# EAGLE schematic schematic (EAGLE 8.5.1)
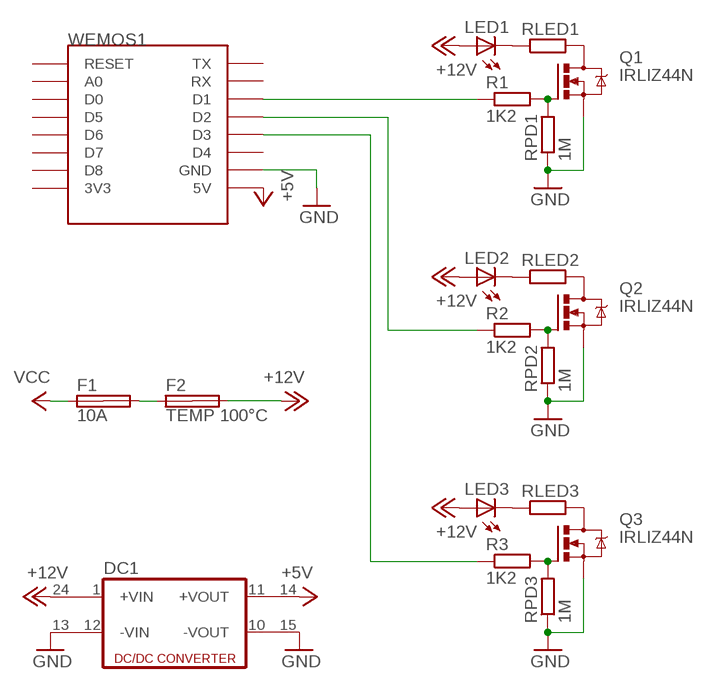
[diagram p0: schematic, sheet 1]

## Parts
DC1  DC213R  [CMK]
F1  10A  SHK20L  [SHK20L]
F2  TEMP 100°C  SHK20L  [SHK20L]
LED1  LED3MM  [LED3MM]
LED2  LED3MM  [LED3MM]
LED3  LED3MM  [LED3MM]
Q1  IRLIZ44N  IRLZ44Z  [TO220BH]
Q2  IRLIZ44N  IRLZ44Z  [TO220BH]
Q3  IRLIZ44N  IRLZ44Z  [TO220BH]
R1  1K2  R-EU_0204/5  [0204/5]
R2  1K2  R-EU_0204/5  [0204/5]
R3  1K2  R-EU_0204/5  [0204/5]
RLED1  R-EU_0204/5  [0204/5]
RLED2  R-EU_0204/5  [0204/5]
RLED3  R-EU_0204/5  [0204/5]
RPD1  1M  R-EU_0204/5  [0204/5]
RPD2  1M  R-EU_0204/5  [0204/5]
RPD3  1M  R-EU_0204/5  [0204/5]
WEMOS1  WEMOS-D1-MINI  [WEMOS-D1-MINI]

## Nets
+5V: DC1.14(+VOUT1) WEMOS1.5V
+12V: DC1.24(+VIN1) F2.2A LED1.A LED2.A LED3.A
GND: DC1.13(-VIN1) DC1.15(-VOUT1) Q1.S Q2.S Q3.S RPD1.1 RPD2.1 RPD3.1 WEMOS1.GND
N$1: Q1.G R1.2 RPD1.2
N$2: Q1.D RLED1.2
N$3: LED1.K(C) RLED1.1
N$4: F1.2A F2.1A
N$5: R1.1 WEMOS1.D1
N$6: Q2.G R2.2 RPD2.2
N$7: Q2.D RLED2.2
N$8: LED2.K(C) RLED2.1
N$9: Q3.G R3.2 RPD3.2
N$10: Q3.D RLED3.2
N$11: LED3.K(C) RLED3.1
N$12: R2.1 WEMOS1.D2
N$13: R3.1 WEMOS1.D3
VCC: F1.1A
Unconnected: DC1.1(+VIN) DC1.10(-VOUT) DC1.11(+VOUT) DC1.12(-VIN) F1.1B F1.2B F2.1B F2.2B WEMOS1.3V3 WEMOS1.A0 WEMOS1.D0 WEMOS1.D4 WEMOS1.D5 WEMOS1.D6 WEMOS1.D7 WEMOS1.D8 WEMOS1.RESET WEMOS1.RX WEMOS1.TX

## Library data of the parts
DC1 = dc-dc-converter:DC213R: DC-DC CONVERTER; OC_FARNELL: unknown; OC_NEWARK: unknown
F1 F2 = fuse:SHK20L: FUSE HOLDER 5 x 20 mm, SH contact, SHH1 Schukat, E1073 Buerklin; OC_FARNELL: unknown; OC_NEWARK: unknown
LED1-LED3 = led:LED: LED OSRAM: - CHIPLED LG R971, LG N971, LY N971, LG Q971, LY Q971, LO R971, LY R971 LH N974, LH R974 LS Q976, LO Q976, LY Q976 LO Q996 - Hyper CHIPLED LW Q18S LB Q993, LB Q99A, LB R99A - SideLED LS A670, LO A670, LY A670, LG A670, LP A670 LB A673, LV A673, LT A673, LW A673 LH A674 LY A675 LS A676, LA A676, LO A676, LY A676, LW A676 LS A679, LY A679, LG A679 - Hyper Micro SIDELED® LS Y876, LA Y876, LO Y876, LY Y876 LT Y87S - SmartLED LW L88C, LW L88S LB L89C, LB L89S, LG L890 LS L89K, LO L89K, LY L89K LS L896, LA L896, LO L896, LY L896 - TOPLED LS T670, LO T670, LY T670, LG T670, LP T670 LSG T670, LSP T670, LSY T670, LOP T670, LYG T670 LG T671, LOG T671, LSG T671 LB T673, LV T673, LT T673, LW T673 LH T674 LS T676, LA T676, LO T676, LY T676, LB T676, LH T676, LSB T676, LW T676 LB T67C, LV T67C, LT T67C, LS T67K, LO T67K, LY T67K, LW E67C LS E67B, LA E67B, LO E67B, LY E67B, LB E67C, LV E67C, LT E67C LW T67C LS T679, LY T679, LG T679 LS T770, LO T770, LY T770, LG T770, LP T770 LB T773, LV T773, LT T773, LW T773 LH T774 LS E675, LA E675, LY E675, LS T675 LS T776, LA T776, LO T776, LY T776, LB T776 LHGB T686 LT T68C, LB T68C - Hyper Mini TOPLED® LB M676 - Mini TOPLED Santana® LG M470 LS M47K, LO M47K, LY M47K Source: http://www.osram.convergy.de LUXEON: - LUMILED® LXK2-PW12-R00, LXK2-PW12-S00, LXK2-PW14-U00, LXK2-PW14-V00 LXK2-PM12-R00, LXK2-PM12-S00, LXK2-PM14-U00 LXK2-PE12-Q00, LXK2-PE12-R00, LXK2-PE12-S00, LXK2-PE14-T00, LXK2-PE14-U00 LXK2-PB12-K00, LXK2-PB12-L00, LXK2-PB12-M00, LXK2-PB14-N00, LXK2-PB14-P00, LXK2-PB14-Q00 LXK2-PR12-L00, LXK2-PR12-M00, LXK2-PR14-Q00, LXK2-PR14-R00 LXK2-PD12-Q00, LXK2-PD12-R00, LXK2-PD12-S00 LXK2-PH12-R00, LXK2-PH12-S00 LXK2-PL12-P00, LXK2-PL12-Q00, LXK2-PL12-R00 Source: www.luxeon.com KINGBRIGHT: KA-3528ASYC Source: www.kingbright.com
Q1-Q3 = transistor-power:IRLZ44Z: N-Channel HEXFET® Power MOSFET Logic Level AUTOMOTIVE MOSFET Source: http://www.irf.com/product-info/datasheets/data/irlz44zpbf.pdf
R1-R3 RLED1-RLED3 RPD1-RPD3 = resistor:R-EU_: RESISTOR, European symbol
WEMOS1 = esp8266modules:WEMOS-D1-MINI: WeMos.cc D1 mini ESP8266 module